# Altium project mantarray_beta2_sensor.PrjPcb (part 2 of 2)
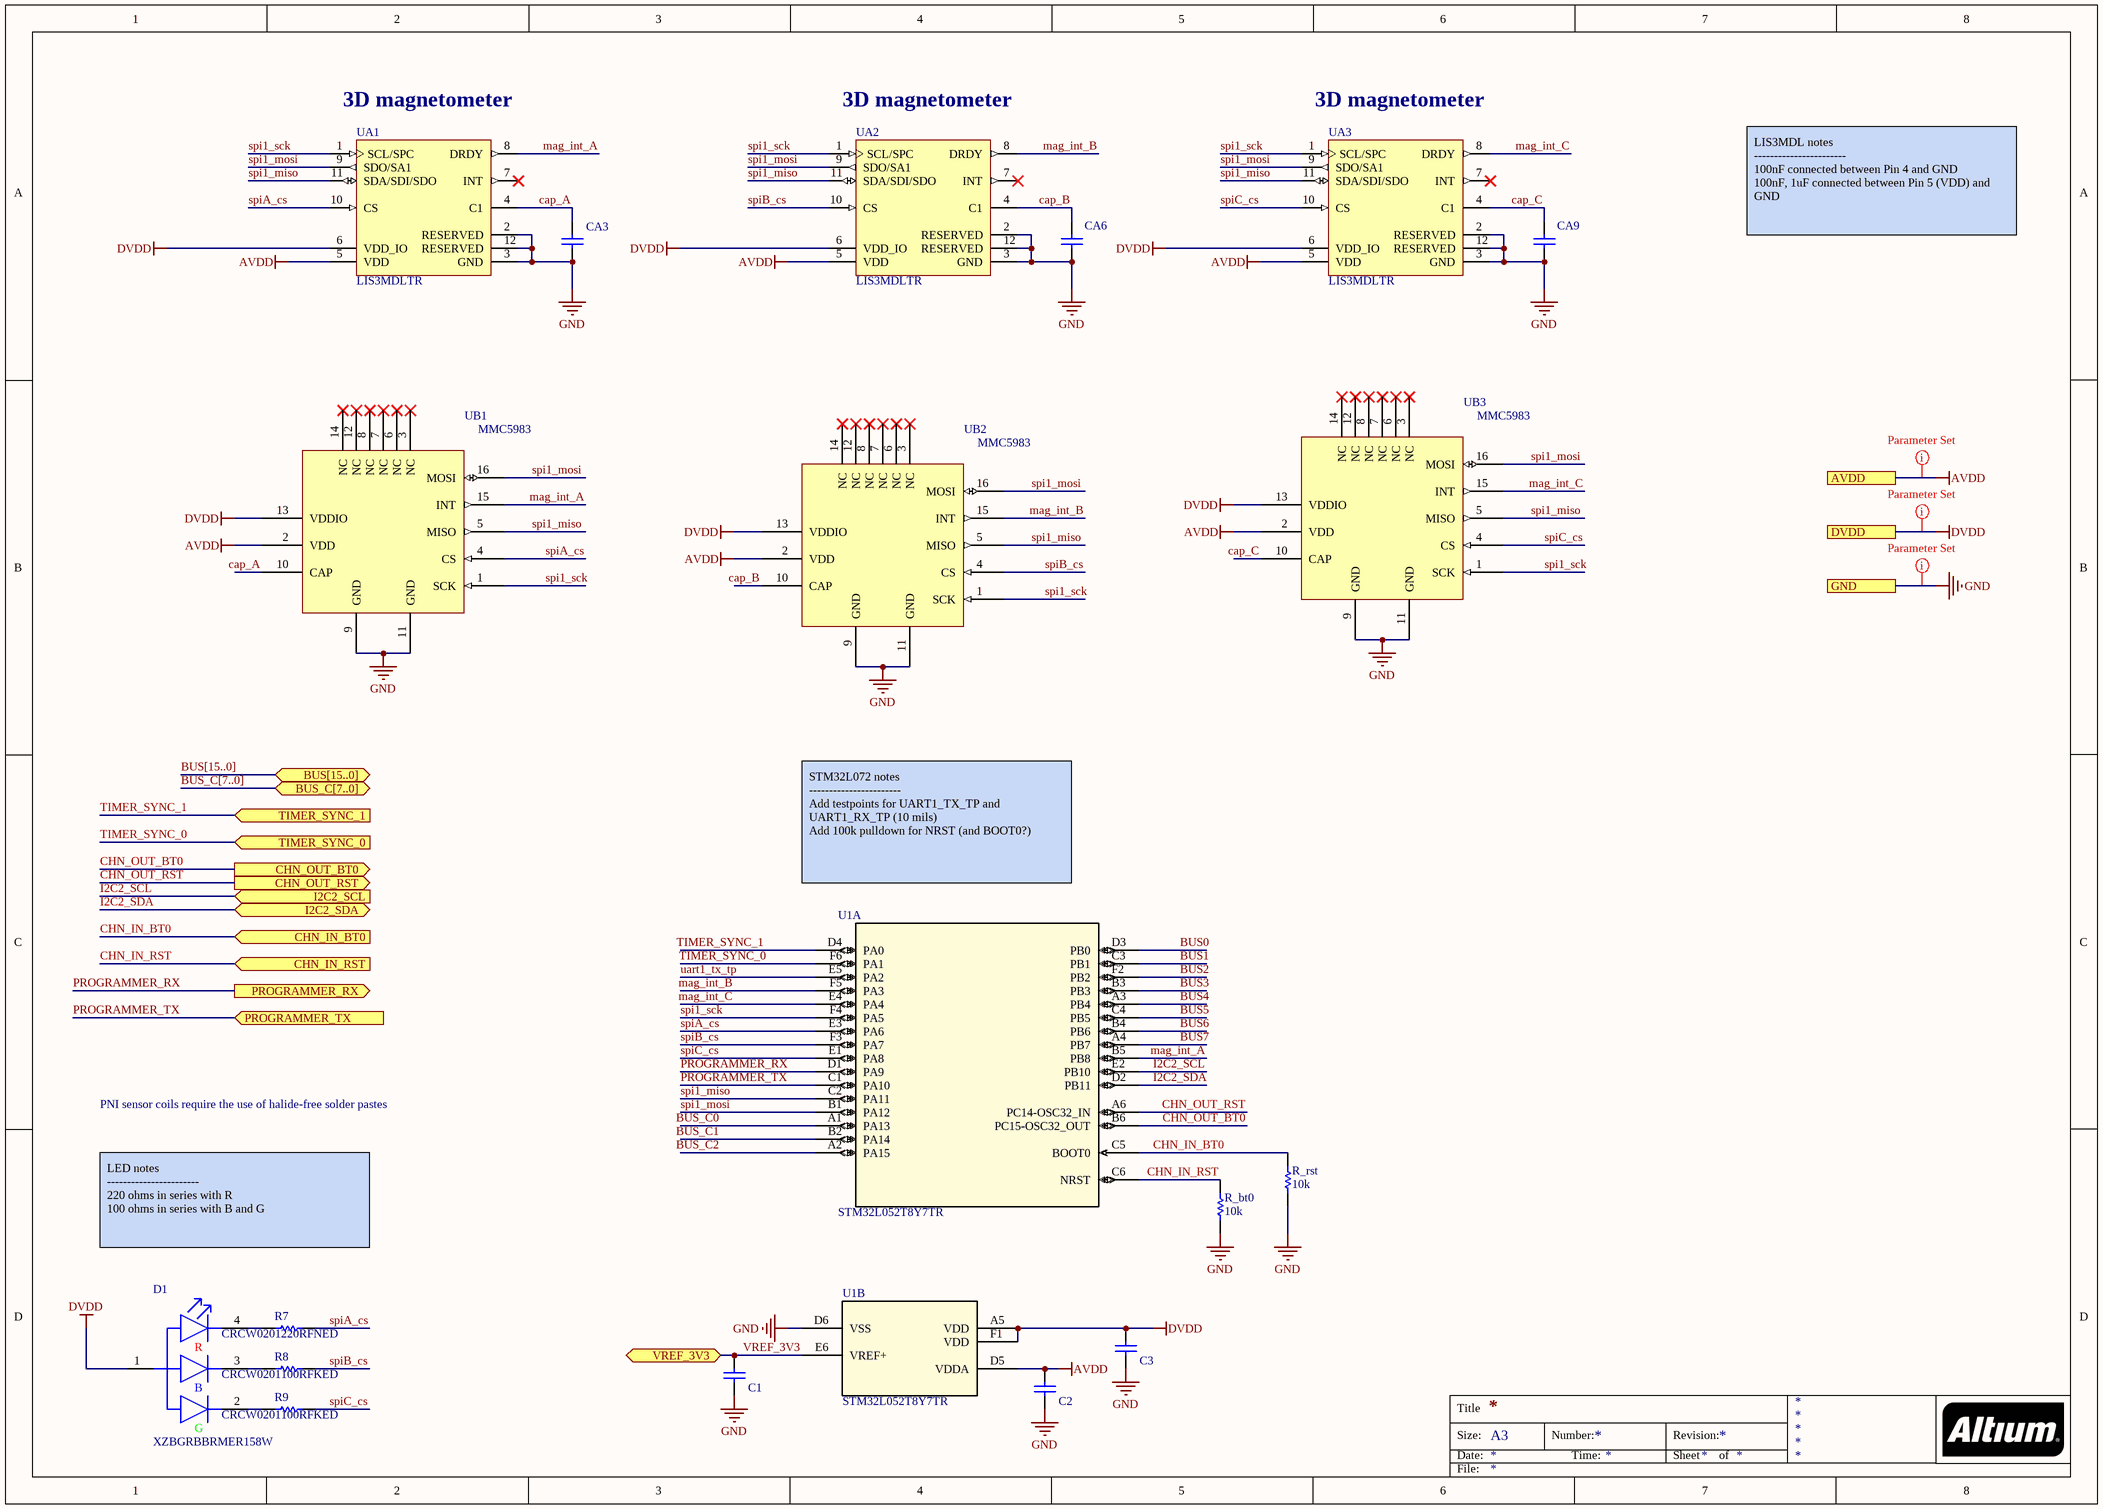
[diagram p7: Channel.SchDoc]

## Nets that join several sheets
+5V: mantarray_beta2_sensor (J1.1), AVDD (C71_AVDD.2 U14_AVDD.3 U14_AVDD.4), DVDD (C71_DVDD.2 U14_DVDD.3 U14_DVDD.4), STM32H745 (Eval_Provide_Power.2 provide_Power_for_eval.2)
AVDD: AVDD (C72_AVDD.2 U14_AVDD.5 U14_AVDD.6 U14_AVDD.7), CH1 (10 pins), CH2 (10 pins), CH3 (10 pins), CH4 (10 pins), CH5 (10 pins), CH6 (10 pins), CH7 (10 pins), CH8 (10 pins), CH9 (10 pins), CH10 (10 pins), CH11 (10 pins), CH12 (10 pins), CH13 (10 pins), CH14 (10 pins), CH15 (10 pins), CH16 (10 pins), CH17 (10 pins), CH18 (10 pins), CH19 (10 pins), CH20 (10 pins), CH21 (10 pins), CH22 (10 pins), CH23 (10 pins), CH24 (10 pins)
AVDD: DVDD (C72_DVDD.2 U14_DVDD.5 U14_DVDD.6 U14_DVDD.7), STM32H745 (Barcode_reader.11), CH1 (10 pins), CH2 (10 pins), CH3 (10 pins), CH4 (10 pins), CH5 (10 pins), CH6 (10 pins), CH7 (10 pins), CH8 (10 pins), CH9 (10 pins), CH10 (10 pins), CH11 (10 pins), CH12 (10 pins), CH13 (10 pins), CH14 (10 pins), CH15 (10 pins), CH16 (10 pins), CH17 (10 pins), CH18 (10 pins), CH19 (10 pins), CH20 (10 pins), CH21 (10 pins), CH22 (10 pins), CH23 (10 pins), CH24 (10 pins)
GND: mantarray_beta2_sensor (J1.2 J1.3), AVDD (5 pins), DVDD (5 pins), STM32H745 (12 pins), CH1 (24 pins), CH2 (24 pins), CH3 (24 pins), CH4 (24 pins), CH5 (24 pins), CH6 (24 pins), CH7 (24 pins), CH8 (24 pins), CH9 (24 pins), CH10 (24 pins), CH11 (24 pins), CH12 (24 pins), CH13 (24 pins), CH14 (24 pins), CH15 (24 pins), CH16 (24 pins), CH17 (24 pins), CH18 (24 pins), CH19 (24 pins), CH20 (24 pins), CH21 (24 pins), CH22 (24 pins), CH23 (24 pins), CH24 (24 pins)
BUS0: STM32H745 (CN12.64), CH1 (U1_CH1.D3), CH2 (U1_CH2.D3), CH3 (U1_CH3.D3), CH4 (U1_CH4.D3), CH5 (U1_CH5.D3), CH6 (U1_CH6.D3), CH7 (U1_CH7.D3), CH8 (U1_CH8.D3), CH9 (U1_CH9.D3), CH10 (U1_CH10.D3), CH11 (U1_CH11.D3), CH12 (U1_CH12.D3), CH13 (U1_CH13.D3), CH14 (U1_CH14.D3), CH15 (U1_CH15.D3), CH16 (U1_CH16.D3), CH17 (U1_CH17.D3), CH18 (U1_CH18.D3), CH19 (U1_CH19.D3), CH20 (U1_CH20.D3), CH21 (U1_CH21.D3), CH22 (U1_CH22.D3), CH23 (U1_CH23.D3), CH24 (U1_CH24.D3)
BUS1: STM32H745 (CN11.61), CH1 (U1_CH1.C3), CH2 (U1_CH2.C3), CH3 (U1_CH3.C3), CH4 (U1_CH4.C3), CH5 (U1_CH5.C3), CH6 (U1_CH6.C3), CH7 (U1_CH7.C3), CH8 (U1_CH8.C3), CH9 (U1_CH9.C3), CH10 (U1_CH10.C3), CH11 (U1_CH11.C3), CH12 (U1_CH12.C3), CH13 (U1_CH13.C3), CH14 (U1_CH14.C3), CH15 (U1_CH15.C3), CH16 (U1_CH16.C3), CH17 (U1_CH17.C3), CH18 (U1_CH18.C3), CH19 (U1_CH19.C3), CH20 (U1_CH20.C3), CH21 (U1_CH21.C3), CH22 (U1_CH22.C3), CH23 (U1_CH23.C3), CH24 (U1_CH24.C3)
BUS2: STM32H745 (CN11.46), CH1 (U1_CH1.F2), CH2 (U1_CH2.F2), CH3 (U1_CH3.F2), CH4 (U1_CH4.F2), CH5 (U1_CH5.F2), CH6 (U1_CH6.F2), CH7 (U1_CH7.F2), CH8 (U1_CH8.F2), CH9 (U1_CH9.F2), CH10 (U1_CH10.F2), CH11 (U1_CH11.F2), CH12 (U1_CH12.F2), CH13 (U1_CH13.F2), CH14 (U1_CH14.F2), CH15 (U1_CH15.F2), CH16 (U1_CH16.F2), CH17 (U1_CH17.F2), CH18 (U1_CH18.F2), CH19 (U1_CH19.F2), CH20 (U1_CH20.F2), CH21 (U1_CH21.F2), CH22 (U1_CH22.F2), CH23 (U1_CH23.F2), CH24 (U1_CH24.F2)
BUS3: STM32H745 (CN11.47), CH1 (U1_CH1.B3), CH2 (U1_CH2.B3), CH3 (U1_CH3.B3), CH4 (U1_CH4.B3), CH5 (U1_CH5.B3), CH6 (U1_CH6.B3), CH7 (U1_CH7.B3), CH8 (U1_CH8.B3), CH9 (U1_CH9.B3), CH10 (U1_CH10.B3), CH11 (U1_CH11.B3), CH12 (U1_CH12.B3), CH13 (U1_CH13.B3), CH14 (U1_CH14.B3), CH15 (U1_CH15.B3), CH16 (U1_CH16.B3), CH17 (U1_CH17.B3), CH18 (U1_CH18.B3), CH19 (U1_CH19.B3), CH20 (U1_CH20.B3), CH21 (U1_CH21.B3), CH22 (U1_CH22.B3), CH23 (U1_CH23.B3), CH24 (U1_CH24.B3)
BUS4: STM32H745 (CN11.48), CH1 (U1_CH1.A3), CH2 (U1_CH2.A3), CH3 (U1_CH3.A3), CH4 (U1_CH4.A3), CH5 (U1_CH5.A3), CH6 (U1_CH6.A3), CH7 (U1_CH7.A3), CH8 (U1_CH8.A3), CH9 (U1_CH9.A3), CH10 (U1_CH10.A3), CH11 (U1_CH11.A3), CH12 (U1_CH12.A3), CH13 (U1_CH13.A3), CH14 (U1_CH14.A3), CH15 (U1_CH15.A3), CH16 (U1_CH16.A3), CH17 (U1_CH17.A3), CH18 (U1_CH18.A3), CH19 (U1_CH19.A3), CH20 (U1_CH20.A3), CH21 (U1_CH21.A3), CH22 (U1_CH22.A3), CH23 (U1_CH23.A3), CH24 (U1_CH24.A3)
BUS5: STM32H745 (CN11.50), CH1 (U1_CH1.C4), CH2 (U1_CH2.C4), CH3 (U1_CH3.C4), CH4 (U1_CH4.C4), CH5 (U1_CH5.C4), CH6 (U1_CH6.C4), CH7 (U1_CH7.C4), CH8 (U1_CH8.C4), CH9 (U1_CH9.C4), CH10 (U1_CH10.C4), CH11 (U1_CH11.C4), CH12 (U1_CH12.C4), CH13 (U1_CH13.C4), CH14 (U1_CH14.C4), CH15 (U1_CH15.C4), CH16 (U1_CH16.C4), CH17 (U1_CH17.C4), CH18 (U1_CH18.C4), CH19 (U1_CH19.C4), CH20 (U1_CH20.C4), CH21 (U1_CH21.C4), CH22 (U1_CH22.C4), CH23 (U1_CH23.C4), CH24 (U1_CH24.C4)
BUS6: STM32H745 (CN11.62), CH1 (U1_CH1.B4), CH2 (U1_CH2.B4), CH3 (U1_CH3.B4), CH4 (U1_CH4.B4), CH5 (U1_CH5.B4), CH6 (U1_CH6.B4), CH7 (U1_CH7.B4), CH8 (U1_CH8.B4), CH9 (U1_CH9.B4), CH10 (U1_CH10.B4), CH11 (U1_CH11.B4), CH12 (U1_CH12.B4), CH13 (U1_CH13.B4), CH14 (U1_CH14.B4), CH15 (U1_CH15.B4), CH16 (U1_CH16.B4), CH17 (U1_CH17.B4), CH18 (U1_CH18.B4), CH19 (U1_CH19.B4), CH20 (U1_CH20.B4), CH21 (U1_CH21.B4), CH22 (U1_CH22.B4), CH23 (U1_CH23.B4), CH24 (U1_CH24.B4)
BUS7: STM32H745 (CN12.44), CH1 (U1_CH1.A4), CH2 (U1_CH2.A4), CH3 (U1_CH3.A4), CH4 (U1_CH4.A4), CH5 (U1_CH5.A4), CH6 (U1_CH6.A4), CH7 (U1_CH7.A4), CH8 (U1_CH8.A4), CH9 (U1_CH9.A4), CH10 (U1_CH10.A4), CH11 (U1_CH11.A4), CH12 (U1_CH12.A4), CH13 (U1_CH13.A4), CH14 (U1_CH14.A4), CH15 (U1_CH15.A4), CH16 (U1_CH16.A4), CH17 (U1_CH17.A4), CH18 (U1_CH18.A4), CH19 (U1_CH19.A4), CH20 (U1_CH20.A4), CH21 (U1_CH21.A4), CH22 (U1_CH22.A4), CH23 (U1_CH23.A4), CH24 (U1_CH24.A4)
BUS_C0: STM32H745 (CN11.57), CH1 (U1_CH1.A1), CH2 (U1_CH2.A1), CH3 (U1_CH3.A1), CH4 (U1_CH4.A1), CH5 (U1_CH5.A1), CH6 (U1_CH6.A1), CH7 (U1_CH7.A1), CH8 (U1_CH8.A1), CH9 (U1_CH9.A1), CH10 (U1_CH10.A1), CH11 (U1_CH11.A1), CH12 (U1_CH12.A1), CH13 (U1_CH13.A1), CH14 (U1_CH14.A1), CH15 (U1_CH15.A1), CH16 (U1_CH16.A1), CH17 (U1_CH17.A1), CH18 (U1_CH18.A1), CH19 (U1_CH19.A1), CH20 (U1_CH20.A1), CH21 (U1_CH21.A1), CH22 (U1_CH22.A1), CH23 (U1_CH23.A1), CH24 (U1_CH24.A1)
BUS_C1: STM32H745 (CN11.55), CH1 (U1_CH1.B2), CH2 (U1_CH2.B2), CH3 (U1_CH3.B2), CH4 (U1_CH4.B2), CH5 (U1_CH5.B2), CH6 (U1_CH6.B2), CH7 (U1_CH7.B2), CH8 (U1_CH8.B2), CH9 (U1_CH9.B2), CH10 (U1_CH10.B2), CH11 (U1_CH11.B2), CH12 (U1_CH12.B2), CH13 (U1_CH13.B2), CH14 (U1_CH14.B2), CH15 (U1_CH15.B2), CH16 (U1_CH16.B2), CH17 (U1_CH17.B2), CH18 (U1_CH18.B2), CH19 (U1_CH19.B2), CH20 (U1_CH20.B2), CH21 (U1_CH21.B2), CH22 (U1_CH22.B2), CH23 (U1_CH23.B2), CH24 (U1_CH24.B2)
BUS_C2: STM32H745 (CN11.4), CH1 (U1_CH1.A2), CH2 (U1_CH2.A2), CH3 (U1_CH3.A2), CH4 (U1_CH4.A2), CH5 (U1_CH5.A2), CH6 (U1_CH6.A2), CH7 (U1_CH7.A2), CH8 (U1_CH8.A2), CH9 (U1_CH9.A2), CH10 (U1_CH10.A2), CH11 (U1_CH11.A2), CH12 (U1_CH12.A2), CH13 (U1_CH13.A2), CH14 (U1_CH14.A2), CH15 (U1_CH15.A2), CH16 (U1_CH16.A2), CH17 (U1_CH17.A2), CH18 (U1_CH18.A2), CH19 (U1_CH19.A2), CH20 (U1_CH20.A2), CH21 (U1_CH21.A2), CH22 (U1_CH22.A2), CH23 (U1_CH23.A2), CH24 (U1_CH24.A2)
CHN_BT0_0: STM32H745 (CN12.45), CH1 (R_rst_CH1.2 U1_CH1.C5)
CHN_BT0_1: CH1 (U1_CH1.B6), CH2 (R_rst_CH2.2 U1_CH2.C5)
CHN_BT0_2: CH2 (U1_CH2.B6), CH3 (R_rst_CH3.2 U1_CH3.C5)
CHN_BT0_3: CH3 (U1_CH3.B6), CH4 (R_rst_CH4.2 U1_CH4.C5)
CHN_BT0_4: CH4 (U1_CH4.B6), CH5 (R_rst_CH5.2 U1_CH5.C5)
CHN_BT0_5: CH5 (U1_CH5.B6), CH6 (R_rst_CH6.2 U1_CH6.C5)
CHN_BT0_6: CH6 (U1_CH6.B6), CH7 (R_rst_CH7.2 U1_CH7.C5)
CHN_BT0_7: CH7 (U1_CH7.B6), CH8 (R_rst_CH8.2 U1_CH8.C5)
CHN_BT0_8: CH8 (U1_CH8.B6), CH9 (R_rst_CH9.2 U1_CH9.C5)
CHN_BT0_9: CH9 (U1_CH9.B6), CH10 (R_rst_CH10.2 U1_CH10.C5)
CHN_BT0_10: CH10 (U1_CH10.B6), CH11 (R_rst_CH11.2 U1_CH11.C5)
CHN_BT0_11: CH11 (U1_CH11.B6), CH12 (R_rst_CH12.2 U1_CH12.C5)
CHN_BT0_12: CH12 (U1_CH12.B6), CH13 (R_rst_CH13.2 U1_CH13.C5)
CHN_BT0_13: CH13 (U1_CH13.B6), CH14 (R_rst_CH14.2 U1_CH14.C5)
CHN_BT0_14: CH14 (U1_CH14.B6), CH15 (R_rst_CH15.2 U1_CH15.C5)
CHN_BT0_15: CH15 (U1_CH15.B6), CH16 (R_rst_CH16.2 U1_CH16.C5)
CHN_BT0_16: CH16 (U1_CH16.B6), CH17 (R_rst_CH17.2 U1_CH17.C5)
CHN_BT0_17: CH17 (U1_CH17.B6), CH18 (R_rst_CH18.2 U1_CH18.C5)
CHN_BT0_18: CH18 (U1_CH18.B6), CH19 (R_rst_CH19.2 U1_CH19.C5)
CHN_BT0_19: CH19 (U1_CH19.B6), CH20 (R_rst_CH20.2 U1_CH20.C5)
CHN_BT0_20: CH20 (U1_CH20.B6), CH21 (R_rst_CH21.2 U1_CH21.C5)
CHN_BT0_21: CH21 (U1_CH21.B6), CH22 (R_rst_CH22.2 U1_CH22.C5)
CHN_BT0_22: CH22 (U1_CH22.B6), CH23 (R_rst_CH23.2 U1_CH23.C5)
CHN_BT0_23: CH23 (U1_CH23.B6), CH24 (R_rst_CH24.2 U1_CH24.C5)
CHN_IN_RST: STM32H745 (CN12.43), CH1 (R_bt0_CH1.2 U1_CH1.C6)
CHN_IN_RST: CH1 (U1_CH1.A6), CH2 (R_bt0_CH2.2 U1_CH2.C6)
CHN_IN_RST: CH2 (U1_CH2.A6), CH3 (R_bt0_CH3.2 U1_CH3.C6)
CHN_IN_RST: CH3 (U1_CH3.A6), CH4 (R_bt0_CH4.2 U1_CH4.C6)
CHN_IN_RST: CH4 (U1_CH4.A6), CH5 (R_bt0_CH5.2 U1_CH5.C6)
CHN_IN_RST: CH5 (U1_CH5.A6), CH6 (R_bt0_CH6.2 U1_CH6.C6)
CHN_IN_RST: CH6 (U1_CH6.A6), CH7 (R_bt0_CH7.2 U1_CH7.C6)
CHN_IN_RST: CH7 (U1_CH7.A6), CH8 (R_bt0_CH8.2 U1_CH8.C6)
CHN_IN_RST: CH8 (U1_CH8.A6), CH9 (R_bt0_CH9.2 U1_CH9.C6)
CHN_IN_RST: CH9 (U1_CH9.A6), CH10 (R_bt0_CH10.2 U1_CH10.C6)
CHN_IN_RST: CH10 (U1_CH10.A6), CH11 (R_bt0_CH11.2 U1_CH11.C6)
CHN_IN_RST: CH11 (U1_CH11.A6), CH12 (R_bt0_CH12.2 U1_CH12.C6)
CHN_IN_RST: CH12 (U1_CH12.A6), CH13 (R_bt0_CH13.2 U1_CH13.C6)
CHN_IN_RST: CH13 (U1_CH13.A6), CH14 (R_bt0_CH14.2 U1_CH14.C6)
CHN_IN_RST: CH14 (U1_CH14.A6), CH15 (R_bt0_CH15.2 U1_CH15.C6)
CHN_IN_RST: CH15 (U1_CH15.A6), CH16 (R_bt0_CH16.2 U1_CH16.C6)
CHN_IN_RST: CH16 (U1_CH16.A6), CH17 (R_bt0_CH17.2 U1_CH17.C6)
CHN_IN_RST: CH17 (U1_CH17.A6), CH18 (R_bt0_CH18.2 U1_CH18.C6)
CHN_IN_RST: CH18 (U1_CH18.A6), CH19 (R_bt0_CH19.2 U1_CH19.C6)
CHN_IN_RST: CH19 (U1_CH19.A6), CH20 (R_bt0_CH20.2 U1_CH20.C6)
CHN_IN_RST: CH20 (U1_CH20.A6), CH21 (R_bt0_CH21.2 U1_CH21.C6)
CHN_IN_RST: CH21 (U1_CH21.A6), CH22 (R_bt0_CH22.2 U1_CH22.C6)
CHN_IN_RST: CH22 (U1_CH22.A6), CH23 (R_bt0_CH23.2 U1_CH23.C6)
CHN_IN_RST: CH23 (U1_CH23.A6), CH24 (R_bt0_CH24.2 U1_CH24.C6)
EN_PWR: AVDD (U14_AVDD.1), DVDD (U14_DVDD.1), STM32H745 (CN11.64)
I2C2_SCL: STM32H745 (CN12.17), CH1 (U1_CH1.E2), CH2 (U1_CH2.E2), CH3 (U1_CH3.E2), CH4 (U1_CH4.E2), CH5 (U1_CH5.E2), CH6 (U1_CH6.E2), CH7 (U1_CH7.E2), CH8 (U1_CH8.E2), CH9 (U1_CH9.E2), CH10 (U1_CH10.E2), CH11 (U1_CH11.E2), CH12 (U1_CH12.E2), CH13 (U1_CH13.E2), CH14 (U1_CH14.E2), CH15 (U1_CH15.E2), CH16 (U1_CH16.E2), CH17 (U1_CH17.E2), CH18 (U1_CH18.E2), CH19 (U1_CH19.E2), CH20 (U1_CH20.E2), CH21 (U1_CH21.E2), CH22 (U1_CH22.E2), CH23 (U1_CH23.E2), CH24 (U1_CH24.E2)
I2C2_SDA: STM32H745 (CN11.21), CH1 (U1_CH1.D2), CH2 (U1_CH2.D2), CH3 (U1_CH3.D2), CH4 (U1_CH4.D2), CH5 (U1_CH5.D2), CH6 (U1_CH6.D2), CH7 (U1_CH7.D2), CH8 (U1_CH8.D2), CH9 (U1_CH9.D2), CH10 (U1_CH10.D2), CH11 (U1_CH11.D2), CH12 (U1_CH12.D2), CH13 (U1_CH13.D2), CH14 (U1_CH14.D2), CH15 (U1_CH15.D2), CH16 (U1_CH16.D2), CH17 (U1_CH17.D2), CH18 (U1_CH18.D2), CH19 (U1_CH19.D2), CH20 (U1_CH20.D2), CH21 (U1_CH21.D2), CH22 (U1_CH22.D2), CH23 (U1_CH23.D2), CH24 (U1_CH24.D2)
PROGRAMMER_RX: STM32H745 (CN11.9), CH1 (U1_CH1.D1), CH2 (U1_CH2.D1), CH3 (U1_CH3.D1), CH4 (U1_CH4.D1), CH5 (U1_CH5.D1), CH6 (U1_CH6.D1), CH7 (U1_CH7.D1), CH8 (U1_CH8.D1), CH9 (U1_CH9.D1), CH10 (U1_CH10.D1), CH11 (U1_CH11.D1), CH12 (U1_CH12.D1), CH13 (U1_CH13.D1), CH14 (U1_CH14.D1), CH15 (U1_CH15.D1), CH16 (U1_CH16.D1), CH17 (U1_CH17.D1), CH18 (U1_CH18.D1), CH19 (U1_CH19.D1), CH20 (U1_CH20.D1), CH21 (U1_CH21.D1), CH22 (U1_CH22.D1), CH23 (U1_CH23.D1), CH24 (U1_CH24.D1)
PROGRAMMER_TX: STM32H745 (CN11.11), CH1 (U1_CH1.C1), CH2 (U1_CH2.C1), CH3 (U1_CH3.C1), CH4 (U1_CH4.C1), CH5 (U1_CH5.C1), CH6 (U1_CH6.C1), CH7 (U1_CH7.C1), CH8 (U1_CH8.C1), CH9 (U1_CH9.C1), CH10 (U1_CH10.C1), CH11 (U1_CH11.C1), CH12 (U1_CH12.C1), CH13 (U1_CH13.C1), CH14 (U1_CH14.C1), CH15 (U1_CH15.C1), CH16 (U1_CH16.C1), CH17 (U1_CH17.C1), CH18 (U1_CH18.C1), CH19 (U1_CH19.C1), CH20 (U1_CH20.C1), CH21 (U1_CH21.C1), CH22 (U1_CH22.C1), CH23 (U1_CH23.C1), CH24 (U1_CH24.C1)
TIMER_SYNC_0: STM32H745 (CN12.4), CH1 (U1_CH1.F6), CH2 (U1_CH2.F6), CH3 (U1_CH3.F6), CH4 (U1_CH4.F6), CH5 (U1_CH5.F6), CH6 (U1_CH6.F6), CH7 (U1_CH7.F6), CH8 (U1_CH8.F6), CH9 (U1_CH9.F6), CH10 (U1_CH10.F6), CH11 (U1_CH11.F6), CH12 (U1_CH12.F6), CH13 (U1_CH13.F6), CH14 (U1_CH14.F6), CH15 (U1_CH15.F6), CH16 (U1_CH16.F6), CH17 (U1_CH17.F6), CH18 (U1_CH18.F6), CH19 (U1_CH19.F6), CH20 (U1_CH20.F6), CH21 (U1_CH21.F6), CH22 (U1_CH22.F6), CH23 (U1_CH23.F6), CH24 (U1_CH24.F6)
TIMER_SYNC_1: STM32H745 (CN12.19), CH1 (U1_CH1.D4), CH2 (U1_CH2.D4), CH3 (U1_CH3.D4), CH4 (U1_CH4.D4), CH5 (U1_CH5.D4), CH6 (U1_CH6.D4), CH7 (U1_CH7.D4), CH8 (U1_CH8.D4), CH9 (U1_CH9.D4), CH10 (U1_CH10.D4), CH11 (U1_CH11.D4), CH12 (U1_CH12.D4), CH13 (U1_CH13.D4), CH14 (U1_CH14.D4), CH15 (U1_CH15.D4), CH16 (U1_CH16.D4), CH17 (U1_CH17.D4), CH18 (U1_CH18.D4), CH19 (U1_CH19.D4), CH20 (U1_CH20.D4), CH21 (U1_CH21.D4), CH22 (U1_CH22.D4), CH23 (U1_CH23.D4), CH24 (U1_CH24.D4)